# Altium schematic sheet DAC.SchDoc
size A4
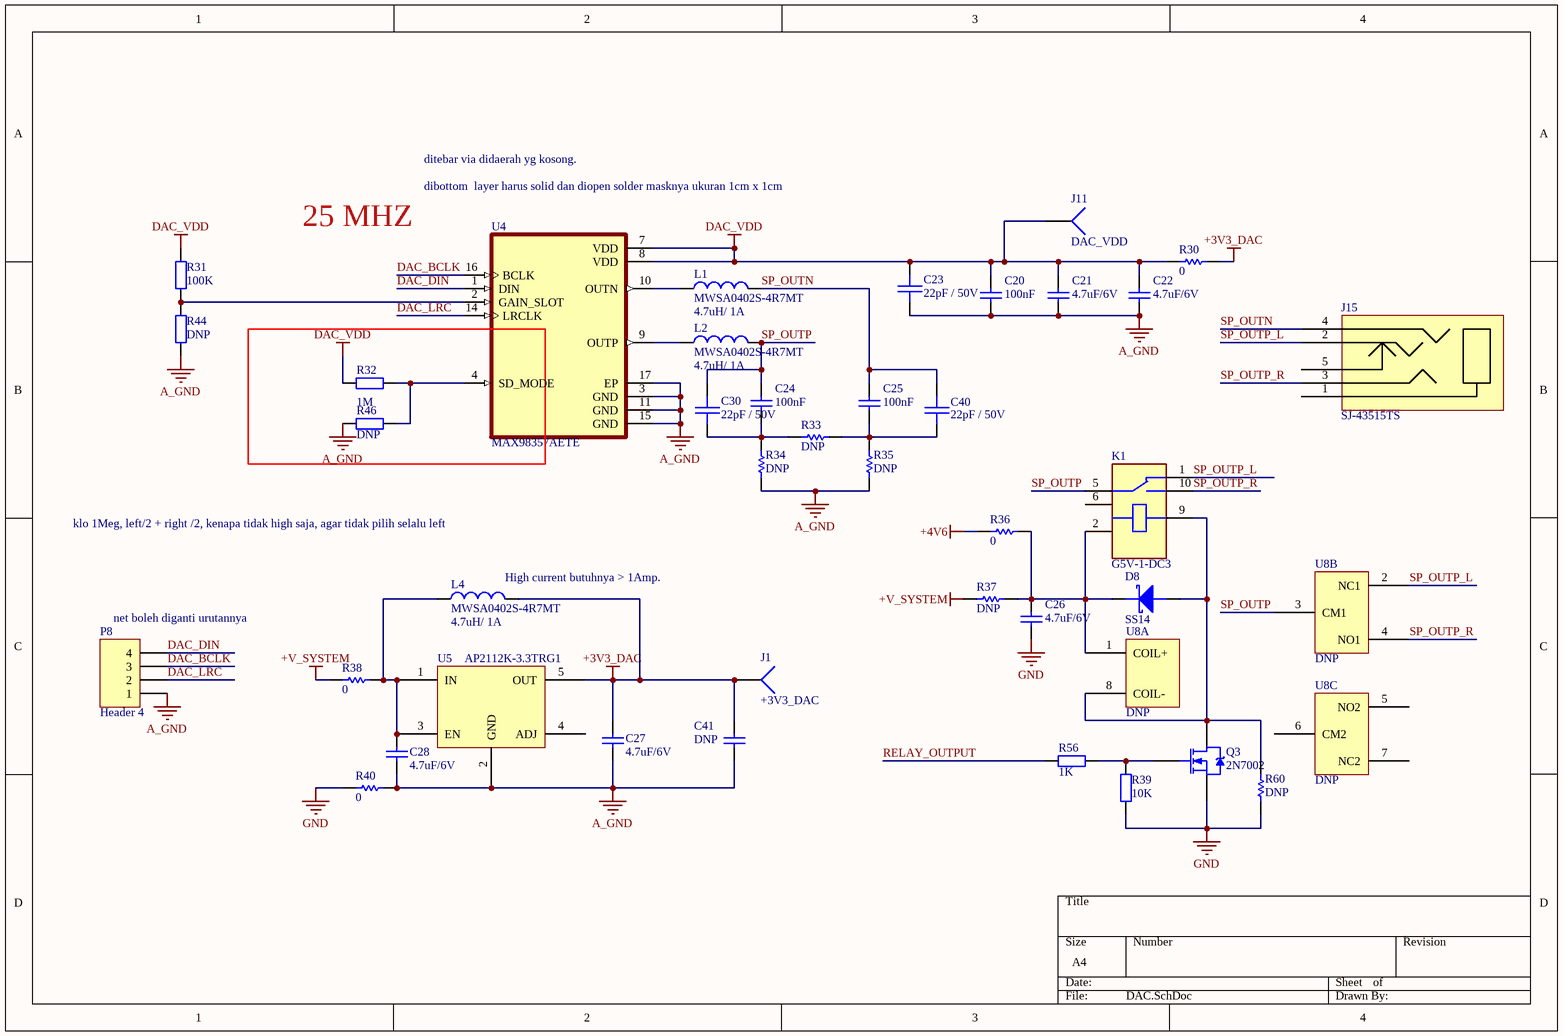
[diagram p0: DAC.SchDoc]

## Parts
C20  100nF  [CR2012-0805]
C21  4.7uF/6V  [CR2012-0805]
C22  4.7uF/6V  [CR2012-0805]
C23  22pF / 50V  [CR2012-0805]
C24  100nF  [CR2012-0805]
C25  100nF  [CR2012-0805]
C26  4.7uF/6V  [CR2012-0805]
C27  4.7uF/6V  [CR2012-0805]
C28  4.7uF/6V  [CR2012-0805]
C30  22pF / 50V  [CR2012-0805]
C40  22pF / 50V  [CR2012-0805]
C41  DNP  [CR2012-0805]
D8  SS14  [DO-214AC (SMA)]
J1  +3V3_DAC  [PIN1]
J11  DAC_VDD  [PIN1]
J15  SJ-43515TS  [SJ-435116]
K1  G5V-1-DC3  [RELAY_G5V-1-DC5]
L1  MWSA0402S-4R7MT  value 4.7uH/ 1A  [IND4X4MM]
L2  MWSA0402S-4R7MT  value 4.7uH/ 1A  [IND4X4MM]
L4  MWSA0402S-4R7MT  value 4.7uH/ 1A  [IND4X4MM]
P8  Header 4  [HDR1X4]
Q3  2N7002  [SOT-23/F2]
R30  0  [JP1_SMD]
R31  100K  [JP2_SMD]
R32  1M  [JP2_SMD]
R33  DNP  [JP2_SMD]
R34  DNP  [JP2_SMD]
R35  DNP  [JP2_SMD]
R36  0  [JP1_SMD]
R37  DNP  [JP1_SMD]
R38  0  [JP1_SMD]
R39  10K  [CR2012-0805]
R40  0  [JP1_SMD]
R44  DNP  [JP2_SMD]
R46  DNP  [JP2_SMD]
R56  1K  [CR2012-0805]
R60  DNP  [JP1_SMD]
U4  MAX98357AETE  [QFN50P300X300X80-17N]
U5  AP2112K-3.3TRG1  [SOT-23-5]
U8  DNP  [EC2-5NU]  (parts A,B,C of 3)

## Nets
+3V3_DAC: C27.2 C41.2 J1.1 L4.2 R30.2 U5.5(OUT)
+4V6: R36.1
+V_SYSTEM: R37.1 R38.1
A_GND: C20.1 C21.1 C22.1 C23.2 C27.1 C28.1 C41.1 P8.1 R34.1 R35.1 R40.2 R44.1 R46.2 U4.3(GND) U4.11(GND) U4.15(GND) U4.17(EP) U5.2(GND)
DAC_VDD: C20.2 C21.2 C22.2 C23.1 J11.1 R30.1 R31.2 R32.1 U4.7(VDD) U4.8(VDD)
GND: C26.1 Q3.S R39.1 R40.1 R60.1
DAC_BCLK: P8.3 U4.16(BCLK)
DAC_DIN: P8.4 U4.1(DIN)
DAC_LRC: P8.2 U4.14(LRCLK)
RELAY_OUTPUT: R56.2
SP_OUTN: C25.2 C40.1 J15.4 L1.2
SP_OUTP: C24.2 C30.1 K1.5(COM) L2.2 U8.3(CM1)
SP_OUTP_L: J15.2 K1.1(NC) U8.2(NC1)
SP_OUTP_R: J15.3 K1.10(NO) U8.4(NO1)
NetC24_1: C24.1 C30.2 R33.1 R34.2
NetC25_1: C25.1 C40.2 R33.2 R35.2
NetC26_2: C26.2 D8.2(K) K1.2(C1) R36.2 R37.2 U8.1(COIL+)
NetC28_2: C28.2 L4.1 R38.2 U5.1(IN) U5.3(EN)
NetD8_1: D8.1(A) K1.9(C2) Q3.D R60.2 U8.8(COIL-)
NetL1_1: L1.1 U4.10(OUTN)
NetL2_1: L2.1 U4.9(OUTP)
NetQ3_G: Q3.G R39.2 R56.1
NetR31_1: R31.1 R44.2 U4.2(GAIN_SLOT)
NetR32_2: R32.2 R46.1 U4.4(SD_MODE)

Not connected (* = marked no-connect by the designer): J15 1 5; K1 6(COM); U5 4(ADJ); U8 5(NO2) 6(CM2) 7(NC2)

## Notes on the sheet
- ditebar via didaerah yg kosong.
- 25 MHZ
- dibottom  layer harus solid dan diopen solder masknya ukuran 1cm x 1cm
- klo 1Meg, left/2 + right /2, kenapa tidak high saja, agar tidak pilih selalu left
- (near L4) High current butuhnya > 1Amp.
- (near P8) net boleh diganti urutannya

## Library data of the parts
C20-C22 C24-C26 C41 = Cap: Capacitor; Published: 8-Jun-2000; LatestRevisionDate: 17-Jul-2002; LatestRevisionNote: Re-released for DXP Platform.; PackageReference: RAD-0.3; Publisher: Altium Limited; PackageDescription: Radial Cap, Thru-Hole; 2 Leads; 0.3 in Pin Spacing
  C20 C24 C25: Value: 100nF
  C21 C22 C26: Value: 4.7uF/6V
  C41: Value: DNP
C23 C30 C40 = SMT_C_0402: Surface mount capacitor 0402
C27 C28 = Cap Semi: Capacitor (Semiconductor SIM Model); Published: 8-Jun-2000; LatestRevisionDate: 29-May-2009; LatestRevisionNote: IPC-7351 Footprint Added.; PackageReference: C1206; Publisher: Altium Limited; PackageDescription: Chip Capacitor; Unit Price: 0.15; Value: 4.7uF/6V
D8 = DIODE SCHOTTKY: Schottky Barrier Diodes; Manufacturer Part Number: SS18; Package / Case: SMA (DO-214AC)
J1 J11 = Socket: LatestRevisionDate: 17-Jul-2002; LatestRevisionNote: Re-released for DXP Platform.; Publisher: Altium Limited
J15 = SJ-43515TS: SJ-43515TS 3.5 MM AUDIO JACK
K1 = G5V-1-DC5: General Purpose Relay SPDT _1 Form C_ Through Hole; MF: Omron Electronics; Package: None; Value: *; Price: None; MP: G5V-1-DC5; Availability: Unavailable; SnapEDA_Link: https://www.snapeda.com/parts/G5V-1-DC5/Omron%20Electronics%20Inc-EMC%20Div/view-part/125140/?ref=snap
L1 L2 L4 = Inductor: Code_IEC: 1005; Published: 8-Jun-2000; LatestRevisionDate: 29-May-2009; LatestRevisionNote: IPC-7351 Footprint Added.; PackageReference: 0402-A; Publisher: Altium Limited; PackageDescription: Chip Inductor; Code_JEITA: 0402
P8 = Header 4: Header, 4-Pin; LatestRevisionDate: 17-Jul-2002; LatestRevisionNote: Re-released for DXP Platform.; Publisher: Altium Limited
Q3 = NMOS_GENERIC_SOT23: N CHANNEL MOSFET GENERIC SCH LIB; Part Number: 2N7002ET1G; Manufacturer: ON Semiconductor; Unit Price: 0.28; Category: Discrete Semiconductor Products; Manufacturer Part Number: 2N7002ET1G; Supplier: Digi-Key; Supplier Part Number: 2N7002ET1GOSDKR-ND
R30 R33-R38 R40 R60 = Res Semi: Semiconductor Resistor; Published: 8-Jun-2000; LatestRevisionDate: 17-Jul-2002; LatestRevisionNote: Re-released for DXP Platform.; PackageReference: AXIAL-0.5; Publisher: Altium Limited; Unit Price: 0.15
  R30 R36 R38 R40: Value: 0
  R33-R35 R37 R60: Value: DNP
R31 R32 R39 R44 R46 R56 = Res2: Resistor; Published: 8-Jun-2000; LatestRevisionDate: 17-Jul-2002; LatestRevisionNote: Re-released for DXP Platform.; PackageReference: AXIAL-0.4; Publisher: Altium Limited; PackageDescription: Axial Device, Thru-Hole; 2 Leads; 0.4 in Pin Spacing
  R31: Value: 100K
  R32: Value: 1M
  R39: Value: 10K
  R44 R46: Value: DNP
  R56: Value: 1K
U4 = MAX98357AETE: Audio Amp Speaker 1-CH Mono 3.2W Class-D 16-Pin TQFN EP T/R; MF: Maxim Integrated; SnapEDA_Link: https://www.snapeda.com/parts/MAX98357AETE/Maxim+Integrated/view-part/?ref=snap; MP: MAX98357AETE; Check_prices: https://www.snapeda.com/parts/MAX98357AETE/Maxim+Integrated/view-part/?ref=eda; Price: None; Purchase-URL: https://pricing.snapeda.com/search/part/MAX98357AETE/?ref=eda; Availability: In Stock; Value: *; Package: None
U5 = AP7311: IC REG LDO ADJ .15A SOT25-5; Manufacturer: Diodes Inc; Current - Limit (Min): 200mA; Number of Regulators: 1; Current - Output: 150mA (Max); Voltage - Input: 2 V ~ 6 V; Voltage - Output: 1.8V; Regulator Topology: Positive Fixed; Supplier Device Package: SOT-25; Package / Case: SC-74A, SOT-753; Mounting Type: Surface Mount; Operating Temperature: -40°C ~ 85°C; Category: Integrated Circuits (ICs); Voltage - Dropout (Typical): -; Supplier: Digi-Key; Packaging: Cut Tape (CT); RoHS: RoHS Compliant; Supplier Part Number: AP7311-18WG-7DICT-ND; ComponentLink1URL: http://www.diodes.com/datasheets/AP7311.pdf; ComponentLink1Description: http://www.diodes.com/datasheets/AP7311.pdf; Pricing: 1=0.5, 10=0.394, 25=0.3324, 100=0.2708, 250=0.22424, 500=0.18526, 1000=0.13875 (USD); Stock: 7183; Manufacturer Part Number: AP2112K-3.3TRG1
U8 = EC2-5NU: EC2-5NU Miniature Signal Relays 4 Volt Control